# EAGLE design Pi_Block (EAGLE 7.2.0)

## Sheet 1 of 2
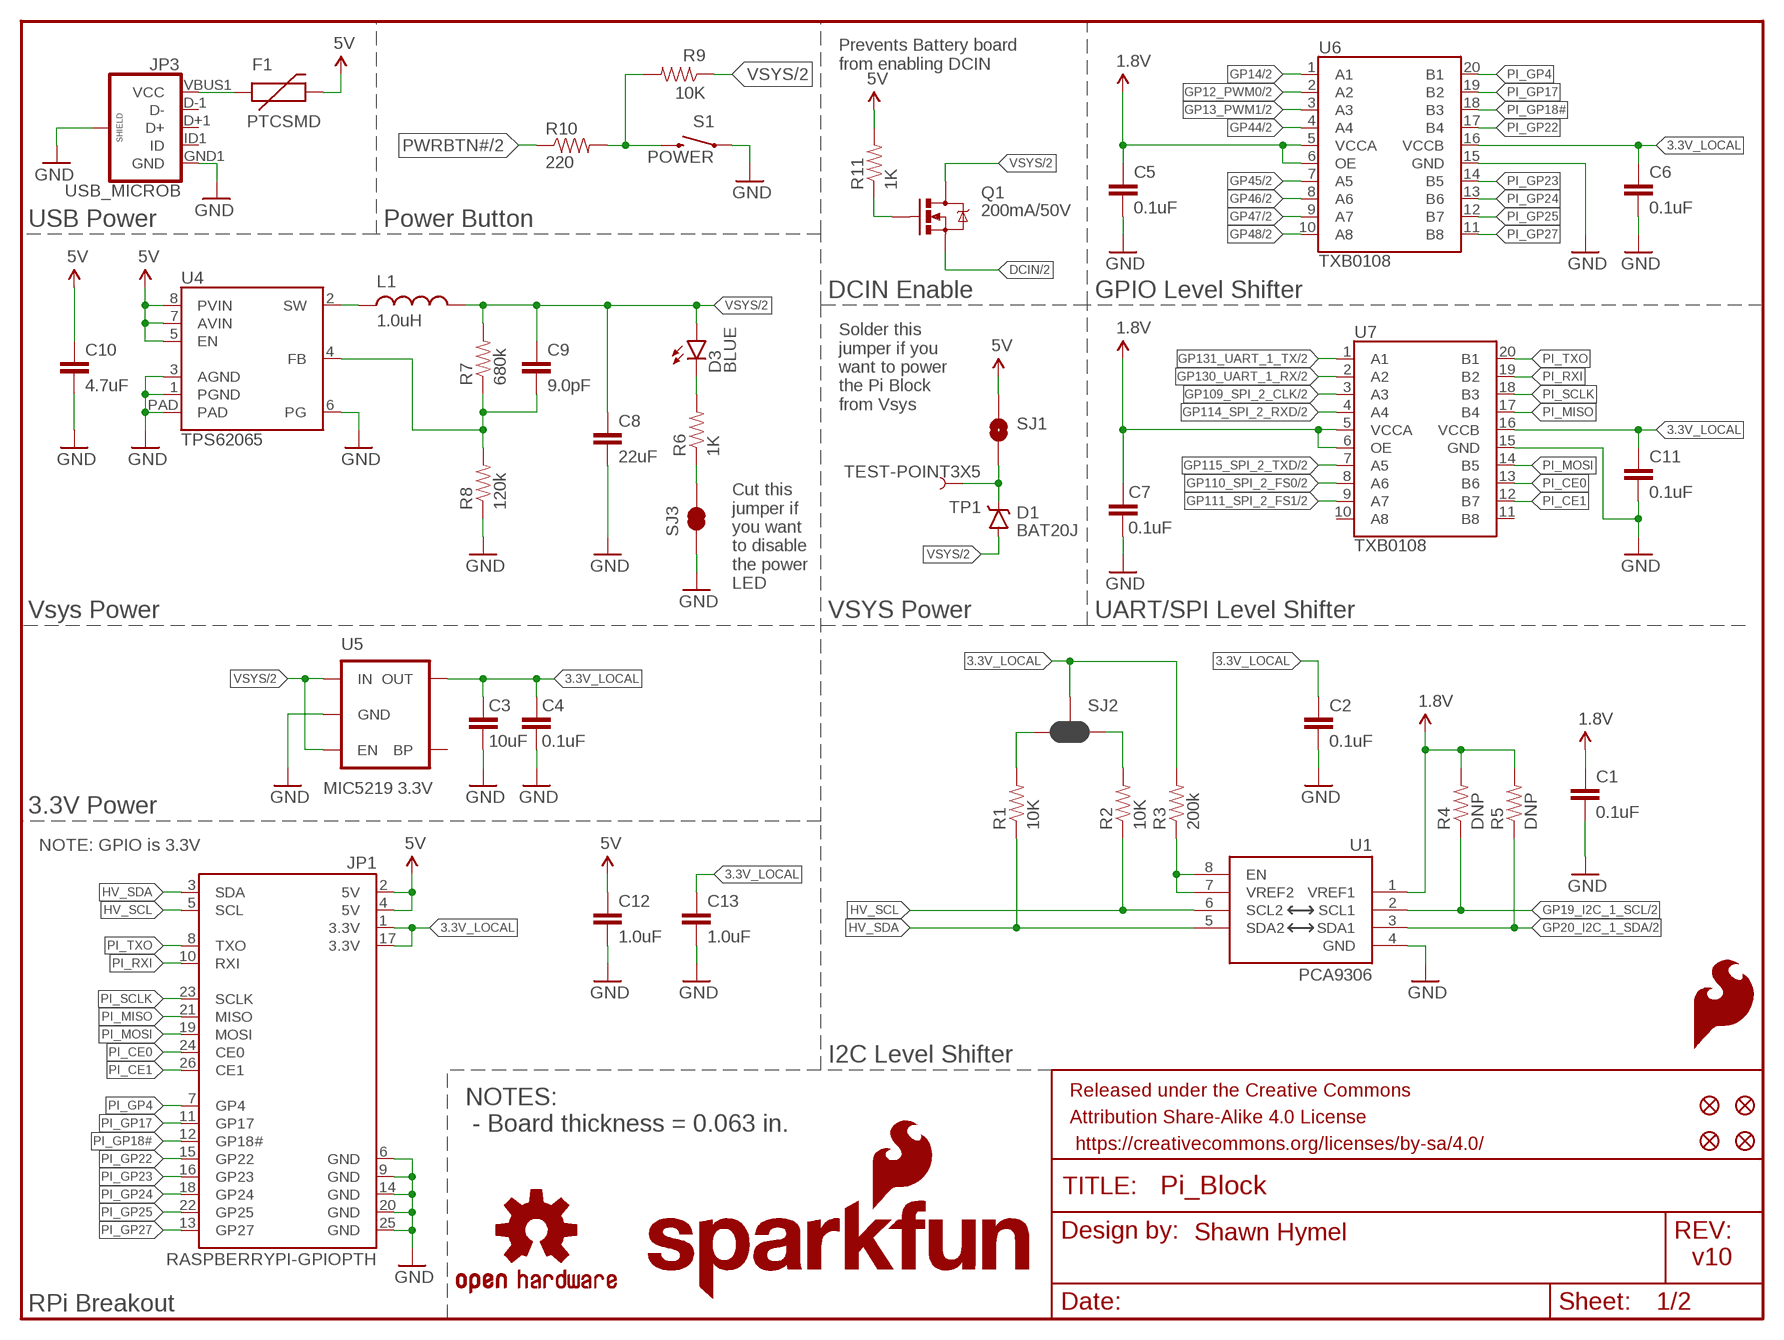
[diagram p0: schematic, sheet 1]

### Parts
C1  0.1uF  0.1UF-25V(+80/-20%)(0603)  [0603-CAP]
C2  0.1uF  0.1UF-25V(+80/-20%)(0603)  [0603-CAP]
C3  10uF  CAP0805  [0805]
C4  0.1uF  0.1UF-25V(+80/-20%)(0603)  [0603-CAP]
C5  0.1uF  0.1UF-25V(+80/-20%)(0603)  [0603-CAP]
C6  0.1uF  0.1UF-25V(+80/-20%)(0603)  [0603-CAP]
C7  0.1uF  0.1UF-25V(+80/-20%)(0603)  [0603-CAP]
C8  22uF  22UF-6.3V-20%(0805)  [0805]
C9  9.0pF  9.0PF-50V-10%(0603)  [0603-CAP]
C10  4.7uF  4.7UF-6.3V-10%(0603)0603  [0603-CAP]
C11  0.1uF  0.1UF-25V(+80/-20%)(0603)  [0603-CAP]
C12  1.0uF  1.0UF-16V-10%(0603)  [0603-CAP]
C13  1.0uF  1.0UF-16V-10%(0603)  [0603-CAP]
D1  BAT20J  DIODE-SCHOTTKY-BAT20J  [SOD-323]
D3  BLUE  LED-BLUE0603  [LED-0603]
F1  PTCSMD  [PTC-1206]
FID1  FIDUCIAL1X2  [FIDUCIAL-1X2]
FID2  FIDUCIAL1X2  [FIDUCIAL-1X2]
FID3  FIDUCIAL1X2  [FIDUCIAL-1X2]
FID4  FIDUCIAL1X2  [FIDUCIAL-1X2]
FRAME1  FRAME-LETTER  [CREATIVE_COMMONS]
FRAME3  FRAME-LETTER  [CREATIVE_COMMONS]
JP1  RASPBERRYPI-GPIOPTH  [2X13-SHROUDED]
JP3  USB_MICROB  USB_MICROB_PLUGCONN-11752  [USB-B-MICRO-SMD_V03]
L1  1.0uH  INDUCTOR  [INDUCTOR-SRP4020]
LOGO1  OSHW-LOGOS  [OSHW-LOGO-S]
LOGO3  SFE_LOGO_FLAME.2_INCH  [SFE_LOGO_FLAME_.2]
LOGO4  SFE_LOGO_NAME_FLAME.1_INCH  [SFE_LOGO_NAME_FLAME_.1]
Q1  200mA/50V  MOSFET-NCHANNELBSS138  [SOT23-3]
R1  10K  10KOHM-1/10W-1%(0603)0603  [0603-RES]
R2  10K  10KOHM-1/10W-1%(0603)0603  [0603-RES]
R3  200k  200KOHM1/10W1%(0603)200K  [0603-RES]
R4  DNP  RESISTOR0603-RES  [0603-RES]
R5  DNP  RESISTOR0603-RES  [0603-RES]
R6  1K  1KOHM-1/10W-1%(0603)  [0603-RES]
R7  680k  RESISTOR0603  [0603-RES]
R8  120k  RESISTOR0603  [0603-RES]
R9  10K  10KOHM-1/10W-1%(0603)0603  [0603-RES]
R10  220  RESISTOR0603  [0603-RES]
R11  1K  1KOHM-1/10W-1%(0603)  [0603-RES]
S1  POWER  SWITCH-MOMENTARY-2TACTILE-SWITCH-SMD-RIGHT-ANGLE  [TACTILE_SWITCH-SMD-RIGHT-ANGLE]
SJ1  JUMPER-PAD-2-NOYES_SILK  [PAD-JUMPER-2-NO_YES_SILK]
SJ2  JUMPER-PAD-3-NC_BY_PASTE  [PAD-JUMPER-3-NC_BY_PASTE_YES_SILK_FULL_BOX]
SJ3  JUMPER-PAD-2-NC_BY_TRACE  [PAD-JUMPER-2-NC_BY_TRACE_YES_SILK]
TP1  TEST-POINT3X5  [PAD.03X.05]
U1  PCA9306  PCA9306PCA9306DC-1:1  [PCA9306DC-1:1]
U4  TPS62065  [WSON-8-PAD]
U5  MIC5219 3.3V  V_REG_MIC52193.3V  [SOT23-5]
U6  TXB0108  [UFDFN-20]
U7  TXB0108  [UFDFN-20]

### Nets
1.8V: C1.1 C5.1 C7.1 R4.2 R5.2 U1.1(VREF1) U6.5(VCCA) U6.6(OE) U7.5(VCCA) U7.6(OE) ; also sheet 2
3.3V_LOCAL: C2.1 C3.1 C4.1 C6.1 C11.1 C13.1 JP1.1(3.3V) JP1.17(3.3V) R3.2 SJ2.2 U5.5(OUT) U6.16(VCCB) U7.16(VCCB)
5V: C10.1 C12.1 F1.2 JP1.2(5V) JP1.4(5V) R11.2 SJ1.1 U4.5(EN) U4.7(AVIN) U4.8(PVIN)
DCIN: Q1.2(S) ; also sheet 2
GND: C1.2 C2.2 C3.2 C4.2 C5.2 C6.2 C7.2 C8.2 C10.2 C11.2 C12.2 C13.2 JP1.6(GND) JP1.9(GND) JP1.14(GND) JP1.20(GND) JP1.25(GND) JP3.GND1(GND) JP3.SHIELD1(SHIELD) JP3.SHIELD2(SHIELD) JP3.SHIELD3(SHIELD) R8.1 S1.1 SJ3.1 U1.4(GND) U4.1(PGND) U4.3(AGND) U4.6(PG) U4.PAD U5.2(GND) U6.15(GND) U7.15(GND) ; also sheet 2
GP12_PWM0: U6.2(A2) ; also sheet 2
GP13_PWM1: U6.3(A3) ; also sheet 2
GP14: U6.1(A1) ; also sheet 2
GP19_I2C_1_SCL: R4.1 U1.2(SCL1) ; also sheet 2
GP20_I2C_1_SDA: R5.1 U1.3(SDA1) ; also sheet 2
GP44: U6.4(A4) ; also sheet 2
GP45: U6.7(A5) ; also sheet 2
GP46: U6.8(A6) ; also sheet 2
GP47: U6.9(A7) ; also sheet 2
GP48: U6.10(A8) ; also sheet 2
GP109_SPI_2_CLK: U7.3(A3) ; also sheet 2
GP110_SPI_2_FS0: U7.8(A6) ; also sheet 2
GP111_SPI_2_FS1: U7.9(A7) ; also sheet 2
GP114_SPI_2_RXD: U7.4(A4) ; also sheet 2
GP115_SPI_2_TXD: U7.7(A5) ; also sheet 2
GP130_UART_1_RX: U7.2(A2) ; also sheet 2
GP131_UART_1_TX: U7.1(A1) ; also sheet 2
HV_SCL: JP1.5(SCL) R2.1 U1.6(SCL2)
HV_SDA: JP1.3(SDA) R1.1 U1.5(SDA2)
N$1: R3.1 U1.7(VREF2) U1.8(EN)
N$2: F1.1 JP3.VBUS1(VCC)
N$3: D1.C SJ1.2 TP1.P$1
N$4: R1.2 SJ2.3
N$5: R2.2 SJ2.1
N$12: D3.C R6.2
N$13: R6.1 SJ3.2
N$15: R9.2 R10.2 S1.2
N$16: Q1.1(G) R11.1
N$18: C9.2 R7.1 R8.2 U4.4(FB)
N$19: L1.P$1 U4.2(SW)
PI_CE0: JP1.24(CE0) U7.13(B6)
PI_CE1: JP1.26(CE1) U7.12(B7)
PI_GP4: JP1.7(GP4) U6.20(B1)
PI_GP17: JP1.11(GP17) U6.19(B2)
PI_GP18#: JP1.12(GP18#) U6.18(B3)
PI_GP22: JP1.15(GP22) U6.17(B4)
PI_GP23: JP1.16(GP23) U6.14(B5)
PI_GP24: JP1.18(GP24) U6.13(B6)
PI_GP25: JP1.22(GP25) U6.12(B7)
PI_GP27: JP1.13(GP27) U6.11(B8)
PI_MISO: JP1.21(MISO) U7.17(B4)
PI_MOSI: JP1.19(MOSI) U7.14(B5)
PI_RXI: JP1.10(RXI) U7.19(B2)
PI_SCLK: JP1.23(SCLK) U7.18(B3)
PI_TXO: JP1.8(TXO) U7.20(B1)
PWRBTN#: R10.1 ; also sheet 2
VSYS: C8.1 C9.1 D1.A D3.A L1.P$2 Q1.3(D) R7.2 R9.1 U5.1(IN) U5.3(EN) ; also sheet 2
Unconnected: JP3.D+1(D+) JP3.D-1(D-) JP3.ID1(ID) U5.4(BP) U7.10(A8) U7.11(B8)

### Notes on the sheet
- Prevents Battery board
  from enabling DCIN
- USB Power | Power Button
- DCIN Enable | GPIO Level Shifter
- Solder this
  jumper if you
  want to power
  the Pi Block
  from Vsys
- Cut this
  jumper if 
  you want
  to disable
  the power
  LED
- Vsys Power | VSYS Power | UART/SPI Level Shifter
- 3.3V Power
- NOTE: GPIO is 3.3V
- I2C Level Shifter
- NOTES:
   - Board thickness = 0.063 in.
- Shawn Hymel
- v10
- RPi Breakout

## Sheet 2 of 2
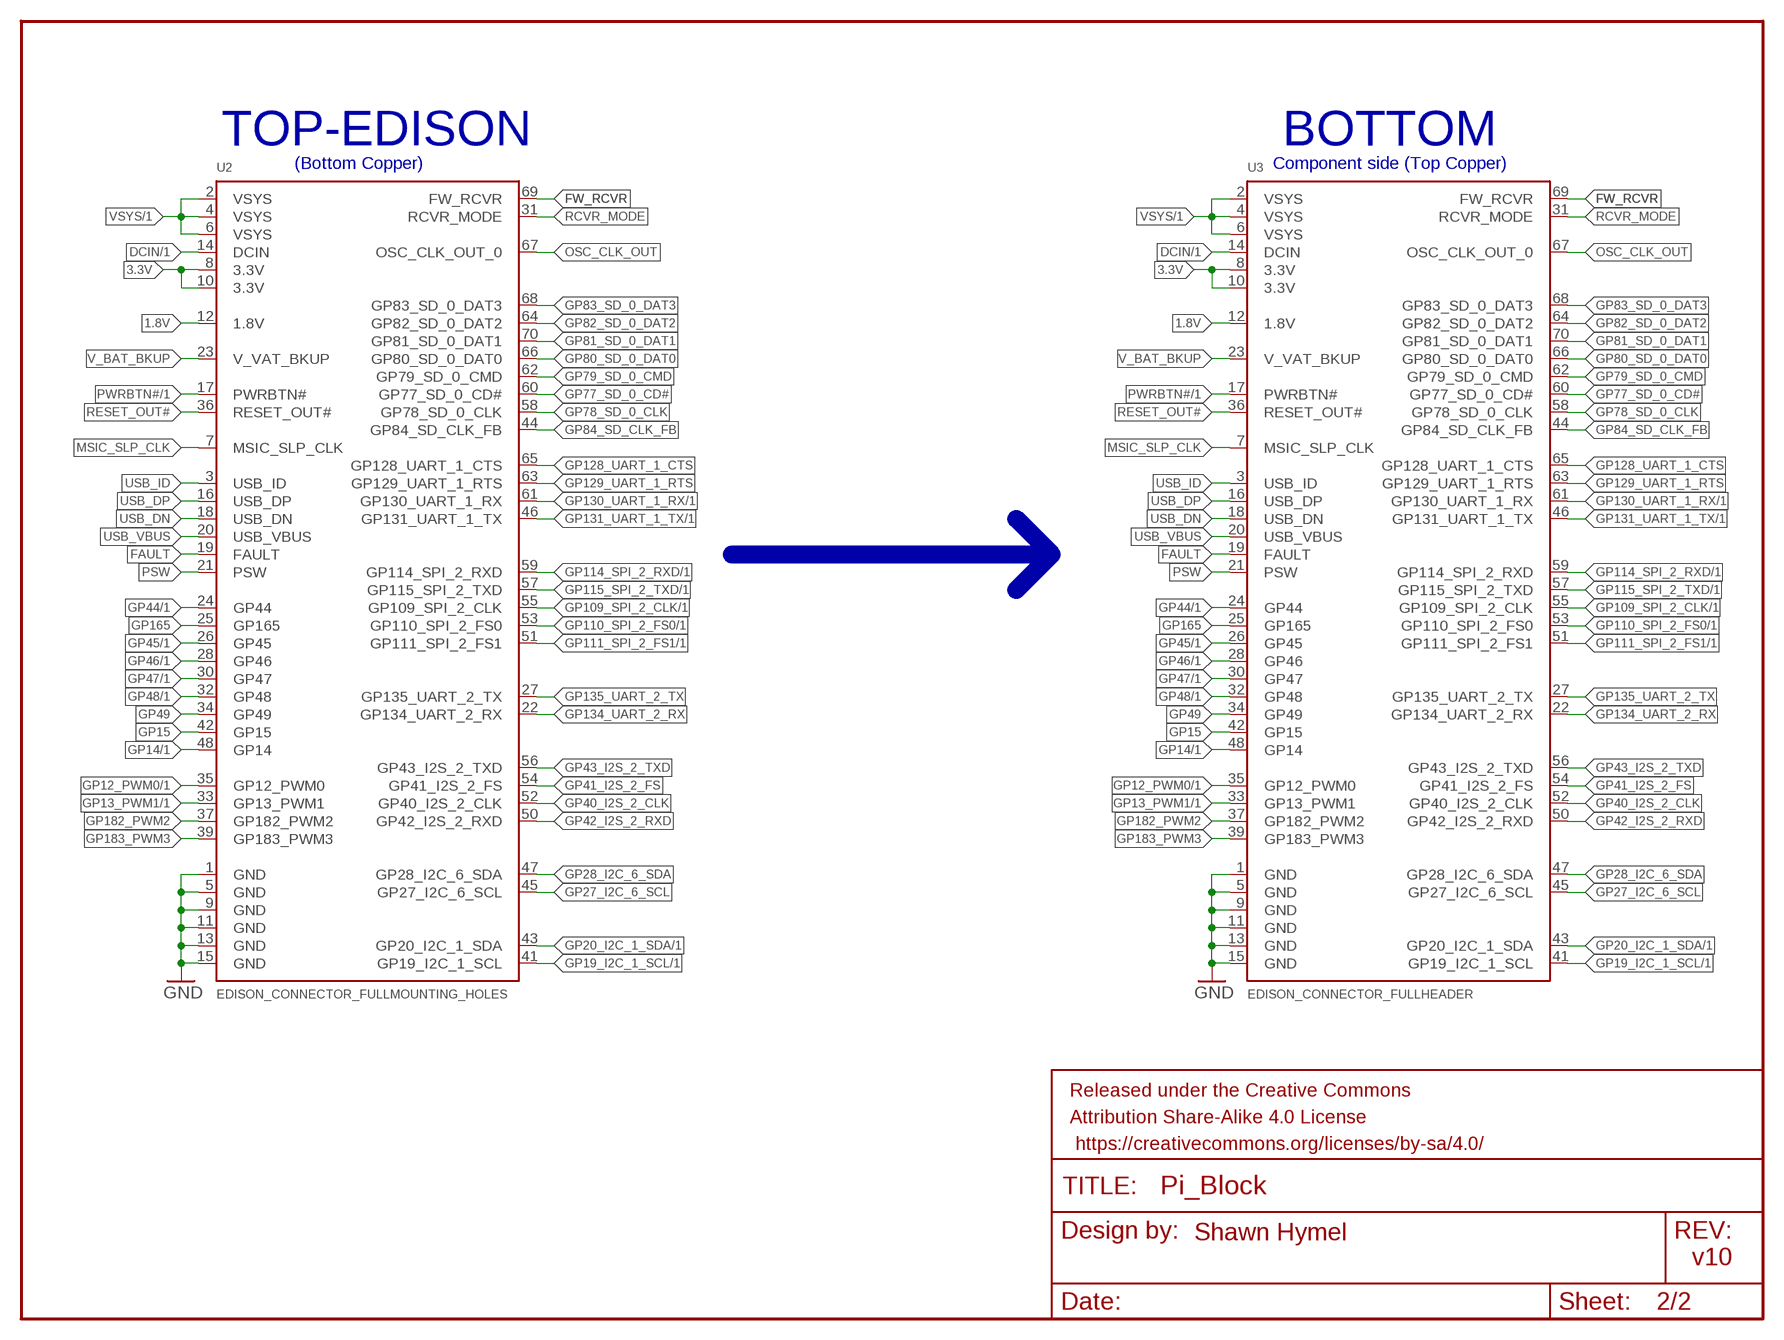
[diagram p1: schematic, sheet 2]

### Parts
FRAME2  FRAME-LETTER  [CREATIVE_COMMONS]
U2  EDISON_CONNECTOR_FULLMOUNTING_HOLES  [EDISON_DAUGHTER]
U3  EDISON_CONNECTOR_FULLHEADER  [DF40C-70DP-0.4(51)]

### Nets
1.8V: U2.12(1.8V) U3.12(1.8V) ; also sheet 1
3.3V: U2.8(3.3V) U2.10(3.3V) U3.8(3.3V) U3.10(3.3V)
DCIN: U2.14(DCIN) U3.14(DCIN) ; also sheet 1
FAULT: U2.19(FAULT) U3.19(FAULT)
FW_RCVR: U2.69(FW_RCVR) U3.69(FW_RCVR)
GND: U2.1(GND) U2.5(GND) U2.9(GND) U2.11(GND) U2.13(GND) U2.15(GND) U3.1(GND) U3.5(GND) U3.9(GND) U3.11(GND) U3.13(GND) U3.15(GND) ; also sheet 1
GP12_PWM0: U2.35(GP12_PWM0) U3.35(GP12_PWM0) ; also sheet 1
GP13_PWM1: U2.33(GP13_PWM1) U3.33(GP13_PWM1) ; also sheet 1
GP14: U2.48(GP14) U3.48(GP14) ; also sheet 1
GP15: U2.42(GP15) U3.42(GP15)
GP19_I2C_1_SCL: U2.41(GP19_I2C_1_SCL) U3.41(GP19_I2C_1_SCL) ; also sheet 1
GP20_I2C_1_SDA: U2.43(GP20_I2C_1_SDA) U3.43(GP20_I2C_1_SDA) ; also sheet 1
GP27_I2C_6_SCL: U2.45(GP27_I2C_6_SCL) U3.45(GP27_I2C_6_SCL)
GP28_I2C_6_SDA: U2.47(GP28_I2C_6_SDA) U3.47(GP28_I2C_6_SDA)
GP40_I2S_2_CLK: U2.52(GP40_I2S_2_CLK) U3.52(GP40_I2S_2_CLK)
GP41_I2S_2_FS: U2.54(GP41_I2S_2_FS) U3.54(GP41_I2S_2_FS)
GP42_I2S_2_RXD: U2.50(GP42_I2S_2_RXD) U3.50(GP42_I2S_2_RXD)
GP43_I2S_2_TXD: U2.56(GP43_I2S_2_TXD) U3.56(GP43_I2S_2_TXD)
GP44: U2.24(GP44) U3.24(GP44) ; also sheet 1
GP45: U2.26(GP45) U3.26(GP45) ; also sheet 1
GP46: U2.28(GP46) U3.28(GP46) ; also sheet 1
GP47: U2.30(GP47) U3.30(GP47) ; also sheet 1
GP48: U2.32(GP48) U3.32(GP48) ; also sheet 1
GP49: U2.34(GP49) U3.34(GP49)
GP77_SD_0_CD#: U2.60(GP77_SD_0_CD#) U3.60(GP77_SD_0_CD#)
GP78_SD_0_CLK: U2.58(GP78_SD_0_CLK) U3.58(GP78_SD_0_CLK)
GP79_SD_0_CMD: U2.62(GP79_SD_0_CMD) U3.62(GP79_SD_0_CMD)
GP80_SD_0_DAT0: U2.66(GP80_SD_0_DAT0) U3.66(GP80_SD_0_DAT0)
GP81_SD_0_DAT1: U2.70(GP81_SD_0_DAT1) U3.70(GP81_SD_0_DAT1)
GP82_SD_0_DAT2: U2.64(GP82_SD_0_DAT2) U3.64(GP82_SD_0_DAT2)
GP83_SD_0_DAT3: U2.68(GP83_SD_0_DAT3) U3.68(GP83_SD_0_DAT3)
GP84_SD_CLK_FB: U2.44(GP84_SD_CLK_FB) U3.44(GP84_SD_CLK_FB)
GP109_SPI_2_CLK: U2.55(GP109_SPI_2_CLK) U3.55(GP109_SPI_2_CLK) ; also sheet 1
GP110_SPI_2_FS0: U2.53(GP110_SPI_2_FS0) U3.53(GP110_SPI_2_FS0) ; also sheet 1
GP111_SPI_2_FS1: U2.51(GP111_SPI_2_FS1) U3.51(GP111_SPI_2_FS1) ; also sheet 1
GP114_SPI_2_RXD: U2.59(GP114_SPI_2_RXD) U3.59(GP114_SPI_2_RXD) ; also sheet 1
GP115_SPI_2_TXD: U2.57(GP115_SPI_2_TXD) U3.57(GP115_SPI_2_TXD) ; also sheet 1
GP128_UART_1_CTS: U2.65(GP128_UART_1_CTS) U3.65(GP128_UART_1_CTS)
GP129_UART_1_RTS: U2.63(GP129_UART_1_RTS) U3.63(GP129_UART_1_RTS)
GP130_UART_1_RX: U2.61(GP130_UART_1_RX) U3.61(GP130_UART_1_RX) ; also sheet 1
GP131_UART_1_TX: U2.46(GP131_UART_1_TX) U3.46(GP131_UART_1_TX) ; also sheet 1
GP134_UART_2_RX: U2.22(GP134_UART_2_RX) U3.22(GP134_UART_2_RX)
GP135_UART_2_TX: U2.27(GP135_UART_2_TX) U3.27(GP135_UART_2_TX)
GP165: U2.25(GP165) U3.25(GP165)
GP182_PWM2: U2.37(GP182_PWM2) U3.37(GP182_PWM2)
GP183_PWM3: U2.39(GP183_PWM3) U3.39(GP183_PWM3)
MSIC_SLP_CLK: U2.7(MSIC_SLP_CLK) U3.7(MSIC_SLP_CLK)
OSC_CLK_OUT: U2.67(OSC_CLK_OUT_0) U3.67(OSC_CLK_OUT_0)
PSW: U2.21(PSW) U3.21(PSW)
PWRBTN#: U2.17(PWRBTN#) U3.17(PWRBTN#) ; also sheet 1
RCVR_MODE: U2.31(RCVR_MODE) U3.31(RCVR_MODE)
RESET_OUT#: U2.36(RESET_OUT#) U3.36(RESET_OUT#)
USB_DN: U2.18(USB_DN) U3.18(USB_DN)
USB_DP: U2.16(USB_DP) U3.16(USB_DP)
USB_ID: U2.3(USB_ID) U3.3(USB_ID)
USB_VBUS: U2.20(USB_VBUS) U3.20(USB_VBUS)
V_BAT_BKUP: U2.23(V_VAT_BKUP) U3.23(V_VAT_BKUP)
VSYS: U2.2(VSYS) U2.4(VSYS) U2.6(VSYS) U3.2(VSYS) U3.4(VSYS) U3.6(VSYS) ; also sheet 1

### Buses
B$1

### Notes on the sheet
- TOP-EDISON | BOTTOM
- (Bottom Copper) | Component side (Top Copper)
- Shawn Hymel
- v10

## Library data of the parts
C1 C2 C4-C7 C11 = SparkFun-Capacitors:0.1UF-25V(+80/-20%)(0603): CAP-00810 Ceramic Standard decoupling cap; PROD_ID: CAP-00810
C3 = SparkFun-Capacitors:CAP: Capacitor Standard 0603 ceramic capacitor, and 0.1" leaded capacitor.; PROD_ID: CAP-11330
C8 = SparkFun-Capacitors:22UF-6.3V-20%(0805): CAP-08402 Ceramic; PROD_ID: CAP-08402
C9 = SparkFun-Capacitors:9.0PF-50V-10%(0603): CAP-09341; PROD_ID: CAP-09341
C10 = SparkFun-Capacitors:4.7UF-6.3V-10%(0603): CAP-08280; PROD_ID: CAP-08280
C12 C13 = SparkFun-Capacitors:1.0UF-16V-10%(0603): CAP-00868; PROD_ID: CAP-00868
D1 = SparkFun-DiscreteSemi:DIODE-SCHOTTKY: Schottky diodes in SFE's production catalog BAT20J 1A 23V 0.62Vf RB751 120mA 40V 0.37Vf PMEG4005EJ 0.5A 40V 0.42Vf MBRA140 1A 40V 0.5Vf B340A 3A 40V SMA; PROD_ID: DIO-11623
D3 = SparkFun-LED:LED-BLUE: Blue LEDs for production use Various blue LEDs stocked by SparkFun production 0603 - DIO-08575 Rebel - DIO-09553 1206 - DIO-09911; PROD_ID: DIO-08575
F1 = SparkFun-PowerIC:PTC: Resettable Fuse PTC Resettable Fuse. Spark Fun Electronics SKU : COM-08357; PROD_ID: RES-11150
FID1-FID4 = SparkFun-Aesthetics:FIDUCIAL: Fiducial Alignment Points Various fiducial points for machine vision alignment.
FRAME1-FRAME3 = SparkFun-Aesthetics:FRAME-LETTER: Schematic Frame Standard 8.5x11 US Letter frame
JP1 = SparkFun-Boards:RASPBERRYPI-GPIO: RASPBERRY PI I/O HEADER As defined for the Revistion 2 Pi.; DIST: sparkfun; DIST_ID: PRT-11490
JP3 = SparkFun-Connectors:USB_MICROB_PLUG: USB Micro-B connectors Some male, some female. Watch your step!; PROD_ID: CONN-11752
L1 = SparkFun-Passives:INDUCTOR: Inductors Basic Inductor/Choke - 0603 and 1206. Footprints are not proven and vary greatly between part numbers. SRN6045- 33uH, 20% 1.4A SDR0403-560KL - 56uH, 10%, 500mA RMS/740mA peak; PROD_ID: NDUC-12274
LOGO1 = SparkFun-Aesthetics:OSHW-LOGO: Open Source Hardware Logo This logo indicates the piece of hardware it is found on incorporates a OSHW license and/or adheres to the definition of open source hardware found here: http://freedomdefined.org/OSHW
LOGO3 = SparkFun-Aesthetics:SFE_LOGO_FLAME: SFE Logo, flame only This is the SparkFun flame logo. The logo on the schematic will always be the same size; the package variant is the height of the flame. Default layer for the logo on the board is tSilk.
LOGO4 = SparkFun-Aesthetics:SFE_LOGO_NAME_FLAME: SFE Logo, name and flame This is the SparkFun full logo. The logo on the schematic will always be the same size; the package variant is the height of the flame part of the logo. Default layer for the logo on the board is tSilk.
Q1 = SparkFun-DiscreteSemi:MOSFET-NCHANNEL: Common NMOSFET Parts MFG P/N Store ID Prod ID FDD8780 TRANS-09984 SI7820DN TRANS-11055 FDS6630A IC-08089 2N7002PW TRANS-11151 FQP30N06L COM-10213 TRANS-10060 BSS123LT1G TRANS-08345 BSS138 TRANS-00830 BS170 2N7000; PROD_ID: TRANS-00830
R1 R2 R9 = SparkFun-Resistors:10KOHM-1/10W-1%(0603): RES-00824; PROD_ID: RES-00824
R3 = SparkFun-Resistors:200KOHM1/10W1%(0603): RES-09385; PROD_ID: RES-09385
R4 R5 = SparkFun-Resistors:RESISTOR: Resistor Basic schematic elements and footprints for 0603, 1206, and PTH resistors.
R6 R11 = SparkFun-Resistors:1KOHM-1/10W-1%(0603): RES-07856; PROD_ID: RES-07856
R7 = SparkFun-Resistors:RESISTOR: Resistor Basic schematic elements and footprints for 0603, 1206, and PTH resistors.; PROD_ID: RES-12280
R8 = SparkFun-Resistors:RESISTOR: Resistor Basic schematic elements and footprints for 0603, 1206, and PTH resistors.; PROD_ID: RES-12279
R10 = SparkFun-Resistors:RESISTOR: Resistor Basic schematic elements and footprints for 0603, 1206, and PTH resistors.; PROD_ID: RES-07861
S1 = SparkFun-Electromechanical:SWITCH-MOMENTARY-2: Various NO switches- pushbuttons, reed, etc; PROD_ID: COMP-12265
SJ1 = SparkFun-Passives:JUMPER-PAD-2-NO
SJ2 = SparkFun-Passives:JUMPER-PAD-3-NC_BY_PASTE
SJ3 = SparkFun-Passives:JUMPER-PAD-2-NC_BY_TRACE
TP1 = SparkFun-Passives:TEST-POINT: Bare copper test points for troubleshooting or ICT
U1 = SparkFun-DigitalIC:PCA9306: Bidirectional I2C level shifter. NOT compatible with all available part number pinout schemes- DOUBLE CHECK!!!; PROD_ID: IC-10023
U2 U3 = Edison:EDISON_CONNECTOR_FULL
U4 = SparkFun-PowerIC:TPS62065: TPS62065 DC/DC step-Down regulator.; PROD_ID: IC-12273
U5 = SparkFun-PowerIC:V_REG_MIC5219: V_REG MIC5219 Standard 3.3V and 5V 500mA LDO voltage regulator in SOT-23 layout. Micrel part MIC5219. BP (by-pass) pin is used to lower output noise with 470pF cap, may be left open.; PROD_ID: VREG-09872
U6 U7 = SparkFun-DigitalIC:TXB0108: 8-Bit Bi-Directional Level Shifter 1.2V-3.6V (VCCA) to 1.65V-5.5V (VCCB) bi-directional level shifter with auto direction sensing. Max data rate - VCCA 1.2V: 20Mbps (50ns), VCCA 3.3V: 100Mbps (10ns) Digikey: 296-27217-1-ND (20-UFDFN) IC-12292; PROD_ID: IC-12292

## Board
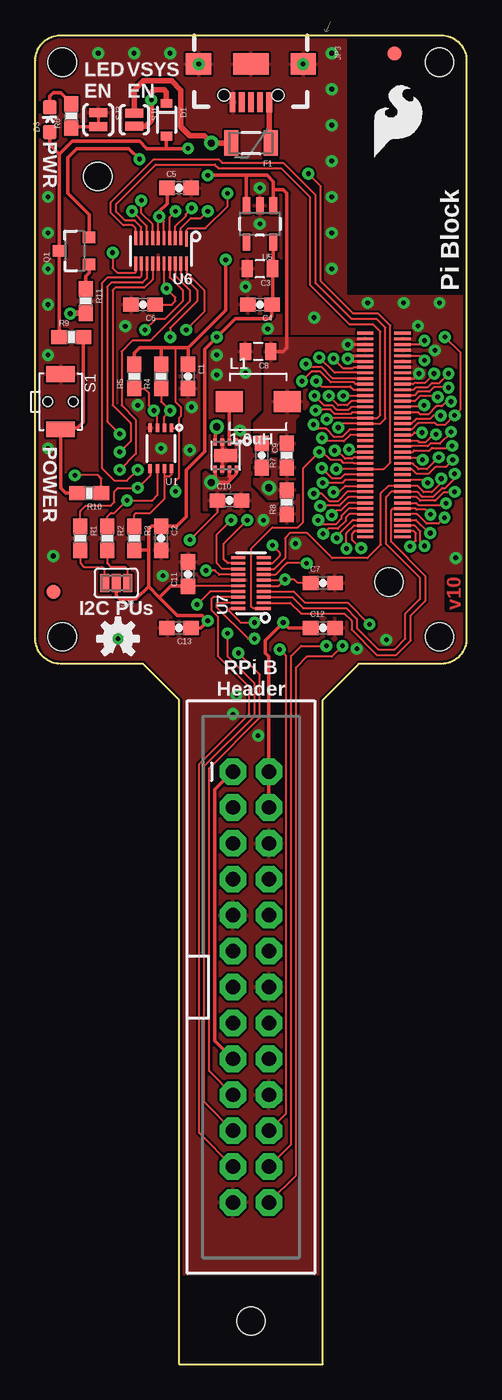
[diagram p2: board, top side]
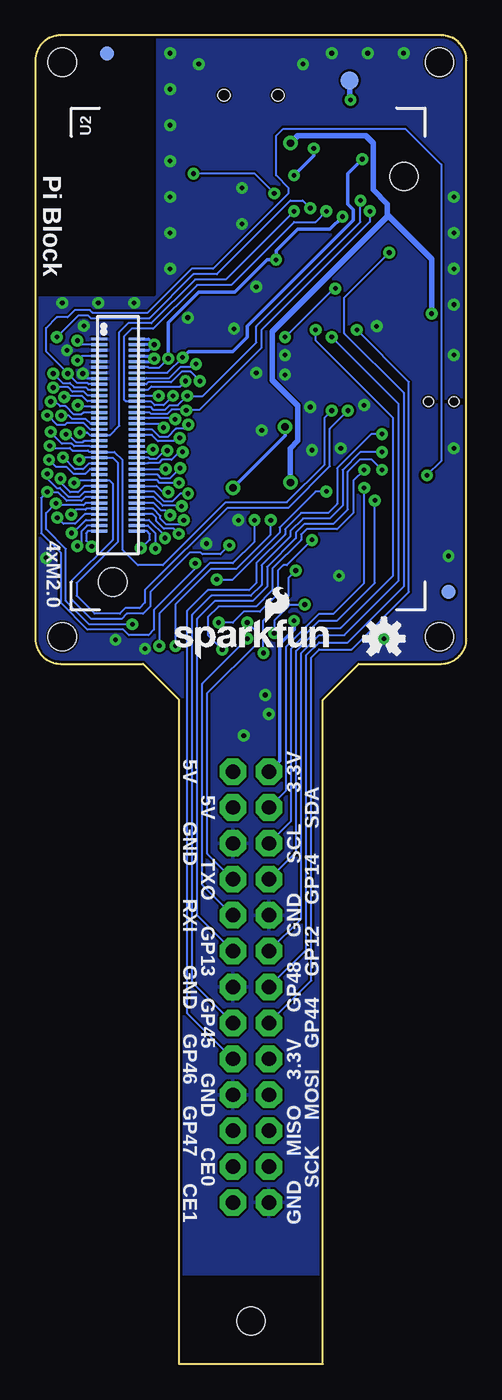
[diagram p3: board, bottom side, seen from below]

Size 30.48 x 93.98 mm. Coordinates in mm from the lower left corner, seen from the top.
Outline: 30.48,92.2 30.48,51.31 arc-90 28.7,49.53 22.86,49.53 20.32,46.99 20.32,0 10.16,0 10.16,46.99 7.62,49.53 1.78,49.53 arc-90 0,51.31 0,92.2 arc-90 1.78,93.98 28.7,93.98 arc-90 30.48,92.2
Copper layers (1*16): Top 0.035mm / dielectric 1.5mm / Bottom 0.035mm
Design rules "Pi_Block *": minimum track width 6mil, minimum drill 13mil, track to track 6mil, track to pad 6mil, pad to pad 6mil, via to via 6mil, smd to smd 6mil, copper to edge 6mil, drill to drill 6mil, minimum pad ring 12mil, minimum via ring 10mil, stop-mask expansion 4mil, vias tented up to drill 20mil, thermal gap 6mil
Holes 2 mm at 28.57,51.44 1.91,51.44 1.91,92.08 28.57,92.08 15.24,3.05
tRestrict: area 22.1,75.7 to 30.5,94; 13 lines
bRestrict: area 22.1,75.7 to 30.5,94; 3 lines

### Footprints (pad centres in the part's own frame; a part is rotated, then mirrored left to right if it is on the bottom)
0603-CAP = smd 1.1 x 1: 1 -0.85,0; 2 0.85,0
0805 = smd 0.8 x 1.2: 1 -0.9,0; 2 0.9,0
SOD-323 = smd 0.63 x 0.83: A 1.15,0; C -1.15,0
LED-0603 = smd 1 x 1: A 0,-0.877; C 0,0.877
PTC-1206 = smd 1 x 1.8: 1 -1.4,0; 2 1.4,0
FIDUCIAL-1X2 = smd 1 x 1: 1 0,0
2X13-SHROUDED = drill 1.016 pad 1.88 octagon: 1 -1.27,15.24; 2 1.27,15.24; 3 -1.27,12.7; 4 1.27,12.7; 5 -1.27,10.16; 6 1.27,10.16; 7 -1.27,7.62; 8 1.27,7.62; 9 -1.27,5.08; 10 1.27,5.08; 11 -1.27,2.54; 12 1.27,2.54; 13 -1.27,0; 14 1.27,0; 15 -1.27,-2.54; 16 1.27,-2.54; 17 -1.27,-5.08; 18 1.27,-5.08; 19 -1.27,-7.62; 20 1.27,-7.62; 21 -1.27,-10.16; 22 1.27,-10.16; 23 -1.27,-12.7; 24 1.27,-12.7; 25 -1.27,-15.24; 26 1.27,-15.24
USB-B-MICRO-SMD_V03 = smd 1.4 x 0.4: D+1 2.7,0; D-1 2.7,0.65; GND1 2.7,-1.3; ID1 2.7,-0.65; VBUS1 2.7,1.3 | smd 1.5 x 1.8: SHIELD1 0,3.7; SHIELD2 0,-3.7 | smd 1.5 x 2.5: SHIELD3 0,0 | hole 0.85: 2.2,1.9; 2.2,-1.9
INDUCTOR-SRP4020 = smd 1.9 x 1.5: P$1 -2.05,0; P$2 2.05,0
SOT23-3 = smd 0.8 x 0.9: 1 -0.95,-1; 2 0.95,-1; 3 0,1.1
0603-RES = smd 1.1 x 1: 1 -0.85,0; 2 0.85,0
TACTILE_SWITCH-SMD-RIGHT-ANGLE = smd 1.1 x 2: 1 -1.95,0; 2 1.95,0 | hole 0.7: 0,0.9; 0,-0.9
PAD-JUMPER-2-NO_YES_SILK = smd 0.635 x 1.27: 1 -0.45,0; 2 0.45,0
PAD-JUMPER-3-NC_BY_PASTE_YES_SILK_FULL_BOX = smd 0.635 x 1.27: 1 -0.813,0; 2 0,0; 3 0.813,0
PAD-JUMPER-2-NC_BY_TRACE_YES_SILK = smd 0.635 x 1.27: 1 -0.508,0; 2 0.508,0
PAD.03X.05 = smd 1.27 x 1.27: P$1 0,0
PCA9306DC-1:1 = smd 0.25 x 0.602: 1 -0.73,-1.446; 2 -0.23,-1.446; 3 0.27,-1.446; 4 0.77,-1.446; 5 0.77,1.431; 6 0.27,1.431; 7 -0.23,1.431; 8 -0.73,1.431
EDISON_DAUGHTER = smd 1.14 x 0.2: 1 1.98,19.17; 2 4.62,19.17; 3 1.98,18.77; 4 4.62,18.77; 5 1.98,18.37; 6 4.62,18.37; 7 1.98,17.97; 8 4.62,17.97; 9 1.98,17.57; 10 4.62,17.57; 11 1.98,17.17; 12 4.62,17.17; 13 1.98,16.77; 14 4.62,16.77; 15 1.98,16.37; 16 4.62,16.37; 17 1.98,15.97; 18 4.62,15.97; 19 1.98,15.57; 20 4.62,15.57; 21 1.98,15.17; 22 4.62,15.17; 23 1.98,14.77; 24 4.62,14.77; 25 1.98,14.37; 26 4.62,14.37; 27 1.98,13.97; 28 4.62,13.97; 29 1.98,13.57; 30 4.62,13.57; 31 1.98,13.17; 32 4.62,13.17; 33 1.98,12.77; 34 4.62,12.77; 35 1.98,12.37; 36 4.62,12.37; 37 1.98,11.97; 38 4.62,11.97; 39 1.98,11.57; 40 4.62,11.57; 41 1.98,11.17; 42 4.62,11.17; 43 1.98,10.77; 44 4.62,10.77; 45 1.98,10.37; 46 4.62,10.37; 47 1.98,9.97; 48 4.62,9.97; 49 1.98,9.57; 50 4.62,9.57; 51 1.98,9.17; 52 4.62,9.17; 53 1.98,8.77; 54 4.62,8.77; 55 1.98,8.37; 56 4.62,8.37; 57 1.98,7.97; 58 4.62,7.97; 59 1.98,7.57; 60 4.62,7.57; 61 1.98,7.17; 62 4.62,7.17; 63 1.98,6.77; 64 4.62,6.77; 65 1.98,6.37; 66 4.62,6.37; 67 1.98,5.97; 68 4.62,5.97; 69 1.98,5.57; 70 4.62,5.57 | hole 2: 23.53,30.67; 2.93,1.98
DF40C-70DP-0.4(51) = smd 0.2 x 1.14 bottom: 1 6.8,1.32; 2 6.8,-1.32; 3 6.4,1.32; 4 6.4,-1.32; 5 6,1.32; 6 6,-1.32; 7 5.6,1.32; 8 5.6,-1.32; 9 5.2,1.32; 10 5.2,-1.32; 11 4.8,1.32; 12 4.8,-1.32; 13 4.4,1.32; 14 4.4,-1.32; 15 4,1.32; 16 4,-1.32; 17 3.6,1.32; 18 3.6,-1.32; 19 3.2,1.32; 20 3.2,-1.32; 21 2.8,1.32; 22 2.8,-1.32; 23 2.4,1.32; 24 2.4,-1.32; 25 2,1.32; 26 2,-1.32; 27 1.6,1.32; 28 1.6,-1.32; 29 1.2,1.32; 30 1.2,-1.32; 31 0.8,1.32; 32 0.8,-1.32; 33 0.4,1.32; 34 0.4,-1.32; 35 0,1.32; 36 0,-1.32; 37 -0.4,1.32; 38 -0.4,-1.32; 39 -0.8,1.32; 40 -0.8,-1.32; 41 -1.2,1.32; 42 -1.2,-1.32; 43 -1.6,1.32; 44 -1.6,-1.32; 45 -2,1.32; 46 -2,-1.32; 47 -2.4,1.32; 48 -2.4,-1.32; 49 -2.8,1.32; 50 -2.8,-1.32; 51 -3.2,1.32; 52 -3.2,-1.32; 53 -3.6,1.32; 54 -3.6,-1.32; 55 -4,1.32; 56 -4,-1.32; 57 -4.4,1.32; 58 -4.4,-1.32; 59 -4.8,1.32; 60 -4.8,-1.32; 61 -5.2,1.32; 62 -5.2,-1.32; 63 -5.6,1.32; 64 -5.6,-1.32; 65 -6,1.32; 66 -6,-1.32; 67 -6.4,1.32; 68 -6.4,-1.32; 69 -6.8,1.32; 70 -6.8,-1.32; NC1 7.2,1.32; NC2 7.2,-1.32; NC3 -7.2,-1.32; NC4 -7.2,1.32
WSON-8-PAD = smd 0.25 x 0.5: 1 -0.75,-0.95; 2 -0.25,-0.95; 3 0.25,-0.95; 4 0.75,-0.95; 5 0.75,0.95; 6 0.25,0.95; 7 -0.25,0.95; 8 -0.75,0.95 | smd 1.6 x 0.9: PAD 0,0
SOT23-5 = smd 0.55 x 1.2: 1 -0.95,-1.3; 2 0,-1.3; 3 0.95,-1.3; 4 0.95,1.3; 5 -0.95,1.3
UFDFN-20 = smd 0.2 x 1.1: 1 -1.8,-0.85 | smd 0.2 x 1: 2 -1.4,-0.9; 3 -1,-0.9; 4 -0.6,-0.9; 5 -0.2,-0.9; 6 0.2,-0.9; 7 0.6,-0.9; 8 1,-0.9; 9 1.4,-0.9; 10 1.8,-0.9; 11 1.8,0.9; 12 1.4,0.9; 13 1,0.9; 14 0.6,0.9; 15 0.2,0.9; 16 -0.2,0.9; 17 -0.6,0.9; 18 -1,0.9; 19 -1.4,0.9; 20 -1.8,0.9

### Placement (x,y rotation side)
C1  10.79,69.85 270 top
C2  8.89,58.42 270 top
C3  15.88,77.47 180 top
C4  15.88,74.93 180 top
C5  10.16,83.19 0 top
C6  7.62,74.93 180 top
C7  20.32,55.25 0 top
C8  15.75,71.63 180 top
C9  16,64.26 270 top
C10  13.72,61.09 0 top
C11  10.79,55.88 90 top
C12  20.32,52.07 0 top
C13  10.16,52.07 180 top
D1  9.27,88.01 270 top
D3  1.02,88.01 0 top
F1  15.24,86.36 180 top
FID1  1.27,54.61 0 top
FID2  25.4,92.71 0 top
FID3  1.27,54.61 0 bottom
FID4  25.4,92.71 0 bottom
FRAME1  -1.27,-16.51 0 top  (outside the outline)
FRAME2  -1.27,-16.51 0 top  (outside the outline)
FRAME3  -1.27,-16.51 0 top  (outside the outline)
JP1  15.24,26.67 0 top
JP3  15.24,91.95 270 top
L1  15.75,68.07 0 top
LOGO1  5.84,51.31 0 top
LOGO2  OSHW-LOGOS  [OSHW-LOGO-S]  5.84,51.31 0 bottom
LOGO3  23.62,85.09 0 top
LOGO4  21.08,49.78 0 bottom
Q1  2.79,78.74 90 top
R1  3.17,58.42 270 top
R2  5.08,58.42 270 top
R3  6.99,58.42 270 top
R4  8.89,69.85 90 top
R5  6.99,69.85 90 top
R6  2.54,88.27 90 top
R7  17.78,64.26 90 top
R8  17.78,60.96 90 top
R9  2.54,72.64 0 top
R10  3.81,61.59 180 top
R11  3.56,75.18 270 top
S1  1.78,68.07 270 top
SJ1  6.99,88.01 270 top
SJ2  5.71,55.25 180 top
SJ3  4.45,88.01 270 top
TP1  8.26,90.81 0 bottom
U1  8.89,64.77 180 top
U2  27.94,53.34 0 bottom
U3  24.64,65.71 90 bottom
U4  13.46,64.26 180 top
U5  15.88,80.64 180 top
U6  8.89,78.74 180 top
U7  15.24,55.25 90 top

### Tracks (layer width: path | path; a pad name or v marks a point on that pad's centre or on a via)
1.8V  (via drill 0.33)
  Top 0.152: U3.12 22.5,70.51 22.45,70.46 21.74,70.46 v21.08,71.12 | 9.91,71.88 9.91,68.07 10.29,67.69 10.29,67.06 10.16,66.93 10.16,66.22 | 10.79,71.75 10.67,71.88 | C7.1 18.54,55.25 18.29,55.5 v17.65,55.5 | v9.91,61.72 9.91,62.48 10.16,62.74 10.16,66.22 | U1.1 10.16,66.22 | U6.5 9.09,80.83 v8.76,81.15 8.69,81.08 U6.6 | U7.6 17.6,55.45 v17.65,55.5 | U7.5 17.2,55.05 v17.65,55.5
  Top 0.254: C5.1 9.31,82.08 8.76,81.53 v8.76,81.15 | 8.89,71.88 7.37,71.88 6.99,71.5 R5.2 | 8.89,71.88 9.91,71.88 10.67,71.88 10.79,71.88 13.46,74.55 v13.46,78.11 | C1.1 10.79,71.75 | R4.2 8.89,71.88
  Bottom 0.152: U3.12 22.5,70.51 22.45,70.46 21.74,70.46 v21.08,71.12 | v9.91,61.72 10.67,61.72 13.21,59.18 13.21,58.8 16.51,55.5 v17.65,55.5
  Bottom 0.254: v21.08,71.12 21.08,73.66 18.92,75.82 16.38,75.82 14.1,78.11 v13.46,78.11 13.46,78.74 11.94,80.26 9.65,80.26 v8.76,81.15
3.3V  (via drill 0.33)
  Top 0.198: U3.8 22.28,71.31 v22.08,71.11 22.28,70.91 U3.10
  Bottom 0.152: U3.8
  Bottom 0.198: U3.8 22.28,71.31 v22.08,71.11 22.28,70.91 U3.10
3.3V_LOCAL  (via drill 0.33)
  Top 0.152: C6.1 9.65,74.93 9.91,75.18 9.91,75.44 v9.27,76.07 9.09,76.25 U6.16 | U7.16 10.81,55.05 C11.1
  Top 0.254: R3.2 7.91,57.57 8,57.66 | JP1.17 12.7,22.86 12.7,40.64 JP1.1 | 8,57.66 8,59.05 8.22,59.27 C2.1 9.99,59.27 10.67,59.94 10.67,63.25 11.96,64.54 11.96,71.78 v12.83,72.64 14.12,73.94 16.54,73.94 16.73,74.13 C4.1 16.77,74.98 C3.1 16.82,77.52 U5.5 | 8,57.66 8,54.99 | 8,54.99 8.76,54.23 | 8.76,54.23 10.03,52.96 11.81,52.96 v12.19,52.58 11.68,52.07 C13.1 | C11.1 9.56,55.03 8.76,54.23 | SJ2.2 5.71,54.36 5.97,54.1 7.11,54.1 8,54.99
  Bottom 0.152: v9.27,76.07 9.4,76.07 v12.83,72.64
  Bottom 0.254: v12.19,52.58 12.19,51.94 13.21,50.93 13.21,42.67 JP1.1
5V  (via drill 0.33, 0.51)
  Top 0.152: C10.1 12.87,60.24 v10.92,58.29
  Top 0.254: JP1.4 JP1.2 16.51,50.04 16.26,50.29 16.26,51.18 v17.53,52.45 17.91,52.07 C12.1 | U4.5 12.71,62.62 v12.45,62.36 13.59,62.36 14.02,62.79 | U4.8 14.21,62.98 14.02,62.79 | 14.02,62.79 13.72,62.79 13.71,62.79 U4.7
  Top 0.381: F1.2 v12.45,86.36 11.94,86.87 10.92,86.87 10.29,87.5 10.29,90.09 9.63,90.75 7.64,90.75 6.99,90.09 SJ1.1 | R11.2 2.5,74.33 v2.46,74.3
  Bottom 0.152: v10.92,58.29 12.7,56.52 12.95,56.52 13.34,56.13 13.34,54.48 14.61,53.21 15.75,53.21 16.51,52.45 v17.53,52.45
  Bottom 0.381: v12.45,62.36 12.45,64.77 11.91,65.3 11.91,67.79 13.72,69.6 13.72,73.03 5.59,81.15 5.59,81.28 | 5.59,81.28 5.59,82.04 6.6,83.06 6.6,86.36 7.11,86.87 11.94,86.87 v12.45,86.36 | v2.46,74.3 2.46,78.16 5.59,81.28
  pour Top (isolate 0.305): 13.46,60.45 11.94,60.45 11.94,62.99 12.57,63.63 14.35,63.63 14.35,63.12 13.46,62.23
DCIN  (via drill 0.33)
  Top 0.152: U2.14 21.15,70.11 v20.07,71.2
  Top 0.254: v7.37,85.22 6.6,85.98 2.92,85.98 2.29,85.34 2.29,82.8 3.79,81.3 Q1.2
  Bottom 0.152: v20.07,71.2 21.15,70.11 U2.14
  Bottom 0.254: v20.07,71.2 19.63,71.63 16.51,71.63 15.49,72.64 15.49,73.41 8,80.9 8,81.66 8.38,82.04 8.38,84.2 v7.37,85.22
FAULT  (via drill 0.33)
  Top 0.152: U3.19 26.75,68.91 26.92,69.09 27.74,69.09 28.04,69.39 28.55,69.39 v29.21,70.05
  Bottom 0.152: v29.21,70.05 28.55,69.39 28.04,69.39 27.74,69.09 26.92,69.09 26.75,68.91 U3.19
FW_RCVR  (via drill 0.33)
  Top 0.152: v26.49,57.84 26.9,58.24 26.9,58.78 26.76,58.91 U3.69
  Bottom 0.152: U3.69 26.76,58.91 26.9,58.78 26.9,58.24 v26.49,57.84
GND  (via drill 0.33)
  Top 0.152: U3.15 26.78,69.71 v27.13,70.05
  Top 0.254: U4.6 13.21,64.01 U4.PAD 13.21,64.51 U4.3
  Bottom 0.152: U3.15 26.78,69.71 v27.13,70.05
  other vias: 28.24,71.7 9.02,55.75 15.88,83.19 11.56,91.95 18.92,91.95 18.39,58.04 16.13,59.69 22.73,50.6 24.82,51.23 7.24,67.82 8.89,64.77 10.92,64.64 11.05,67.69 14.48,66.04 12.83,71.37 12.83,69.98 14.86,70.1 6.35,73.41 16.43,73.23 14.86,76.2 20.95,92.71 20.95,90.17 20.95,87.63 20.95,85.09 20.95,82.55 20.95,80.01 20.95,77.47 28.57,75.06 26.04,75.06 23.5,75.06 27.05,73.43 9.53,92.71 6.99,92.71 4.45,92.71 1.27,57.15 5.84,51.31 14.22,47.32 13.97,45.97 15.75,44.45 29.72,57.02 0.89,82.55 0.89,80.01 0.89,77.47 0.89,74.93 15.88,80.64 0.89,71.37 0.89,64.77 19.71,74.02
  pour Bottom (isolate 0.152, rank 6): 30.48,92.2 30.48,51.31 arc-90 28.7,49.53 22.86,49.53 20.32,46.99 20.32,6.35 10.16,6.35 10.16,46.99 7.62,49.53 1.78,49.53 arc-90 0,51.31 0,92.2 arc-90 1.78,93.98 28.7,93.98 arc-90
  pour Top (isolate 0.051, rank 6): 30.48,51.26 arc-90 28.75,49.53 22.86,49.53 20.32,46.99 20.32,6.35 10.16,6.35 10.16,46.99 7.62,49.53 1.78,49.53 arc-90 0,51.31 0,92.2 arc-90 1.78,93.98 28.7,93.98 arc-90 30.48,92.2
GP12_PWM0  (via drill 0.33)
  Top 0.152: U3.35 26.64,65.71 26.82,65.89 v27.33,65.89 | v12.19,81.53 11.71,81.05 11,81.05 10.29,80.34 U6.2
  Bottom 0.152: v27.33,65.89 26.82,65.89 26.64,65.71 U3.35 | U3.35 | U3.35 25.2,65.71 24.54,66.37 24.54,73 23.93,73.61 22.28,73.61 19.18,76.71 17.02,76.71 v12.19,81.53
GP13_PWM1  (via drill 0.33)
  Top 0.152: U3.33 26.61,66.11 27.05,66.55 28.27,66.55 28.4,66.42 28.93,66.42 29.62,67.11 v29.64,67.11 30.07,67.54 30.07,71.53 v28.96,72.64 | v11.05,81.76 10.62,81.33 10.62,81.2 9.89,80.48 U6.3
  Bottom 0.152: U3.33 26.61,66.11 27.05,66.55 28.27,66.55 28.4,66.42 28.93,66.42 29.62,67.11 v29.64,67.11 | v28.96,72.64 27.43,74.17 26.75,74.17 26.57,73.99 22.4,73.99 19.3,77.09 17.65,77.09 12.45,82.3 11.58,82.3 v11.05,81.76
GP14  (via drill 0.33)
  Top 0.152: U3.48 24.63,63.31 25.09,63.78 25.09,73.46 24.26,74.3 22.48,74.3 20.19,76.58 20.19,83.31 v19.3,84.2 | U3.48 | v13.59,82.8 13.59,81.91 12.01,80.34 10.79,80.34 10.69,80.23 U6.1 | U3.48 v21.27,63.31
  Bottom 0.152: v13.59,82.8 14.99,84.2 v19.3,84.2 | U3.48 v21.27,63.31
GP15  (via drill 0.33)
  Top 0.152: U3.42 22.36,64.51 v22.17,64.69
  Bottom 0.152: v22.17,64.69 22.36,64.51 U3.42
GP19_I2C_1_SCL  (via drill 0.33)
  Top 0.152: U3.41 26.66,64.51 26.77,64.62 27.86,64.62 28.04,64.8 29.31,64.8 v29.46,64.95 | U1.2 9.12,67.03 v9.53,67.44 8.89,68.07 R4.1
  Bottom 0.152: v29.46,64.95 29.31,64.8 28.04,64.8 27.86,64.62 26.77,64.62 26.66,64.51 U3.41 24.89,64.51 24.31,63.93 24.31,57.58 23.24,56.52 21.46,56.52 17.02,60.96 12.7,60.96 10.03,63.63 10.03,66.93 v9.53,67.44
GP20_I2C_1_SDA  (via drill 0.33)
  Top 0.152: U3.43 27.23,64.11 v27.38,63.96 | R5.1 7.71,69 8,68.71 8,67.82 v8.38,67.44 8.62,67.2 U1.3
  Bottom 0.152: 27.23,64.11 v27.38,63.96 27.23,64.11 U3.43 | U3.43 | U3.43 24.99,64.11 24.66,63.78 24.66,58.14 27.56,55.25 27.56,54.36 26.29,53.09 24.51,53.09 24.13,53.47 23.11,53.47 22.73,53.85 22.73,54.74 16.89,60.58 12.57,60.58 9.65,63.5 9.65,66.17 v8.38,67.44
GP27_I2C_6_SCL  (via drill 0.33)
  Top 0.152: v28.52,64.14 27.69,63.3 27.1,63.3 26.69,63.71 U3.45
  Bottom 0.152: U3.45 26.69,63.71 27.1,63.3 27.69,63.3 v28.52,64.14
GP28_I2C_6_SDA  (via drill 0.33)
  Top 0.152: U3.47 26.61,63.31 26.92,62.99 27.81,62.99 28.3,63.48 29.03,63.48 v29.52,63.96
  Bottom 0.152: v29.52,63.96 29.03,63.48 28.3,63.48 27.81,62.99 26.92,62.99 26.61,63.31 U3.47
GP40_I2S_2_CLK  (via drill 0.33)
  Top 0.152: U3.52 21.87,62.51 21.69,62.33 v20.32,62.33
  Bottom 0.152: v20.32,62.33 21.69,62.33 21.87,62.51 U3.52
GP41_I2S_2_FS  (via drill 0.33)
  Top 0.152: v21.08,61.67 21.46,61.67 21.9,62.11 U3.54
  Bottom 0.152: U3.54 21.9,62.11 21.46,61.67 v21.08,61.67
GP42_I2S_2_RXD  (via drill 0.33)
  Top 0.152: U3.50 21.84,62.91 21.57,62.64 20.98,62.64 v20.24,63.37
  Bottom 0.152: v20.24,63.37 20.98,62.64 21.57,62.64 21.84,62.91 U3.50
GP43_I2S_2_TXD  (via drill 0.33)
  Top 0.152: U3.56 22.06,61.71 21.36,61.01 20.8,61.01 20.24,61.57 v19.68,61.57
  Bottom 0.152: v19.68,61.57 20.24,61.57 20.8,61.01 21.36,61.01 22.06,61.71 U3.56
GP44  (via drill 0.33)
  Top 0.152: U3.24 22.34,68.11 22.05,67.82 21.41,67.82 v20.75,68.48 | v9.91,81.53 9.49,81.12 U6.4
  Bottom 0.152: v20.75,68.48 21.41,67.82 22.05,67.82 22.34,68.11 U3.24 24.09,68.11 24.18,68.2 24.18,72.72 23.67,73.23 22.15,73.23 19.05,76.33 16.64,76.33 12.19,80.77 10.67,80.77 v9.91,81.53
GP45  (via drill 0.33)
  Top 0.152: v19.74,68.48 20.4,67.82 20.98,67.82 21.29,67.51 22.17,67.51 22.37,67.71 U3.26 | v7.49,82.3 7.49,81.41 8.29,80.61 U6.7
  Bottom 0.152: U3.26 22.37,67.71 22.17,67.51 21.29,67.51 20.98,67.82 20.4,67.82 v19.74,68.48 18.64,68.48 14.86,72.26 14.86,73.41 7.49,80.77 v7.49,82.3
GP46  (via drill 0.33)
  Top 0.152: U3.28 22.4,67.31 22.3,67.21 21.16,67.21 20.85,67.51 19.86,67.51 v19.81,67.46 | U6.8 7.89,80.48 v6.83,81.53
  Bottom 0.152: v19.81,67.46 19.86,67.51 | 19.86,67.51 20.85,67.51 21.16,67.21 22.3,67.21 22.4,67.31 U3.28 | 19.86,67.51 18.85,67.51 14.48,71.88 14.48,73.15 6.83,80.8 v6.83,81.53
GP47  (via drill 0.33)
  Top 0.152: v20.6,66.83 20.68,66.9 22.43,66.9 22.43,66.91 U3.30 24.16,66.91 24.38,67.13 24.38,73.03 23.88,73.53 22.23,73.53 19.43,76.33 19.43,82.55 17.4,84.58 12.95,84.58 12.7,84.84 8.51,84.84 5.71,82.04 5.71,81.51 6.35,80.87 7.04,80.87 7.49,80.42 U6.9
  Bottom 0.152: v20.6,66.83 20.68,66.9 22.43,66.9 22.43,66.91 U3.30
GP48  (via drill 0.33)
  Top 0.152: v21.41,66.24 21.68,66.51 U3.32 24.37,66.51 24.74,66.88 24.74,73.3 24.13,73.91 22.35,73.91 19.81,76.45 19.81,82.68 17.53,84.96 13.21,84.96 12.95,85.22 8.38,85.22 5.33,82.17 5.33,81.43 6.22,80.54 6.88,80.54 7.09,80.34 U6.10
  Bottom 0.152: U3.32 21.68,66.51 v21.41,66.24
GP49  (via drill 0.33)
  Top 0.152: U3.34 22.22,66.11 21.69,65.58 21.13,65.58 20.55,66.17 19.94,66.17 v19.66,66.45
  Bottom 0.152: v19.66,66.45 19.94,66.17 20.55,66.17 21.13,65.58 21.69,65.58 22.22,66.11 U3.34
GP77_SD_0_CD#  (via drill 0.33)
  Top 0.152: U3.60 22.12,60.91 21.59,60.38 21.29,60.38 v20.95,60.05
  Bottom 0.152: v20.95,60.05 21.29,60.38 21.59,60.38 22.12,60.91 U3.60
GP78_SD_0_CLK  (via drill 0.33)
  Top 0.152: U3.58 22.09,61.31 21.49,60.71 20.17,60.71 v20.14,60.68
  Bottom 0.152: v20.14,60.68 20.17,60.71 21.49,60.71 22.09,61.31 U3.58
GP79_SD_0_CMD  (via drill 0.33)
  Top 0.152: U3.62 22.16,60.51 21.64,60 21.64,59.79 21.23,59.39 20.3,59.39 v19.99,59.69
  Bottom 0.152: v19.99,59.69 20.3,59.39 21.23,59.39 21.64,59.79 21.64,60 22.16,60.51 U3.62
GP80_SD_0_DAT0  (via drill 0.33)
  Top 0.152: v21.31,58.42 21.31,58.57 22.45,59.71 U3.66
  Bottom 0.152: U3.66 22.45,59.71 21.31,58.57 v21.31,58.42
GP81_SD_0_DAT1  (via drill 0.33)
  Top 0.152: U3.70 22.56,58.91 22.38,58.73 22.38,58.32 22.99,57.71 v23.04,57.71
  Bottom 0.152: v23.04,57.71 22.99,57.71 22.38,58.32 22.38,58.73 22.56,58.91 U3.70
GP82_SD_0_DAT2  (via drill 0.33)
  Top 0.152: U3.64 22.19,60.11 21.95,59.87 21.95,59.64 21.39,59.08 20.7,59.08 v20.34,58.73
  Bottom 0.152: v20.34,58.73 20.7,59.08 21.39,59.08 21.95,59.64 21.95,59.87 22.19,60.11 U3.64
GP83_SD_0_DAT3  (via drill 0.33)
  Top 0.152: v22,57.68 22,58.78 22.53,59.31 U3.68
  Bottom 0.152: U3.68 22.53,59.31 22,58.78 v22,57.68
GP84_SD_CLK_FB  (via drill 0.33)
  Top 0.152: U3.44 22.48,64.11 22.4,64.03 21.9,64.03 21.32,64.62 v21.16,64.62
  Bottom 0.152: v21.16,64.62 21.32,64.62 21.9,64.03 22.4,64.03 22.48,64.11 U3.44 | U3.44
GP109_SPI_2_CLK  (via drill 0.33)
  Top 0.152: v29.64,62.97 29.64,62.64 28.98,61.98 28.75,61.98 28.14,61.37 27.33,61.37 26.99,61.71 U3.55 25.16,61.71 24.79,61.34 24.79,58.01 27.18,55.63 27.18,54.1 26.16,53.09 26.16,51.31 25.4,50.55 24.26,50.55 22.73,52.07 22.73,52.7 21.97,53.47 18.92,53.47 18.14,54.25 U7.3
  Bottom 0.152: v29.64,62.97 29.64,62.64 28.98,61.98 28.75,61.98 28.14,61.37 27.33,61.37 26.99,61.71 U3.55
GP110_SPI_2_FS0  (via drill 0.33)
  Top 0.152: v28.7,62.64 28.7,62.36 28.02,61.67 27.46,61.67 27.02,62.11 U3.53 24.95,62.11 24.43,61.59 24.43,57.96 23.47,57 20.98,57 19.18,58.8 18.03,58.8 17.65,58.42 17.65,57.02 16.88,56.25 U7.8
  Bottom 0.152: U3.53 27.02,62.11 27.46,61.67 28.02,61.67 28.7,62.36 v28.7,62.64
GP111_SPI_2_FS1  (via drill 0.33)
  Top 0.152: v27.74,62.33 27.56,62.51 U3.51 | v16.76,57.91 17.27,57.4 17.27,57.15 16.77,56.65 U7.9
  Bottom 0.152: 25.25,62.51 25.02,62.28 25.02,58.29 27.94,55.37 27.94,54.1 26.54,52.7 24.38,52.7 24,53.09 22.86,53.09 22.35,53.59 22.35,54.61 19.56,57.4 18.8,57.4 18.67,57.28 17.4,57.28 v16.76,57.91 | 25.25,62.51 | v27.74,62.33 27.56,62.51 U3.51 | U3.51 | U3.51 25.25,62.51 | U3.51
GP114_SPI_2_RXD  (via drill 0.33)
  Top 0.152: U3.59 26.92,60.91 27.08,60.76 28.91,60.76 v29.03,60.88 | v23.62,52.32 22.1,53.85 19.05,53.85 18.25,54.65 U7.4
  Bottom 0.152: U3.59 26.92,60.91 27.08,60.76 28.91,60.76 v29.03,60.88 29.72,60.2 29.72,59.05 28.32,57.66 28.32,53.98 26.67,52.32 v23.62,52.32
GP115_SPI_2_TXD  (via drill 0.33)
  Top 0.152: U3.57 26.95,61.31 27.2,61.06 28.27,61.06 28.88,61.67 29.62,61.67 v29.64,61.7 | v19.18,56.64 17.78,56.64 16.98,55.84 U7.7
  Bottom 0.152: v29.64,61.7 29.62,61.67 28.88,61.67 28.27,61.06 27.2,61.06 26.95,61.31 U3.57 | 29.97,61.37 v29.64,61.7 | v29.64,61.7 30.07,61.27 30.07,58.78 28.7,57.4 28.7,53.85 26.8,51.94 24.26,51.94 23.88,51.56 22.48,51.56 22.1,51.94 22.1,53.34 19.18,56.26 v19.18,56.64
GP128_UART_1_CTS  (via drill 0.33)
  Top 0.152: U3.65 26.9,59.71 27.84,58.78 v27.91,58.78
  Bottom 0.152: v27.91,58.78 27.84,58.78 26.9,59.71 U3.65
GP129_UART_1_RTS  (via drill 0.33)
  Top 0.152: v28.93,59.87 28.5,59.44 27.66,59.44 26.99,60.11 U3.63
  Bottom 0.152: U3.63 26.99,60.11 27.66,59.44 28.5,59.44 v28.93,59.87
GP130_UART_1_RX  (via drill 0.33)
  Top 0.152: v27.94,60.1 27.61,60.43 26.95,60.43 26.87,60.51 U3.61 25.28,60.51 25.15,60.38 25.15,58.17 27.56,55.75 27.56,53.98 26.54,52.96 26.54,51.18 25.53,50.16 24.13,50.16 22.35,51.94 22.35,52.58 21.84,53.09 18.8,53.09 18.04,53.84 U7.2
  Bottom 0.152: U3.61 26.87,60.51 26.95,60.43 27.61,60.43 v27.94,60.1
GP131_UART_1_TX  (via drill 0.33)
  Top 0.152: U3.46 22.52,63.71 22.5,63.73 21.77,63.73 21.54,63.96 20.85,63.96 20.3,64.52 v20.07,64.52 18.92,63.37 18.92,59.56 18.54,59.18 16.76,59.18 15.24,57.66 15.24,53.59 15.39,53.45 U7.1
  Bottom 0.152: v20.07,64.52 20.3,64.52 20.85,63.96 21.54,63.96 21.77,63.73 22.5,63.73 22.52,63.71 U3.46
GP134_UART_2_RX  (via drill 0.33)
  Top 0.152: v21.77,68.48 21.8,68.51 U3.22
  Bottom 0.152: U3.22 21.8,68.51 v21.77,68.48
GP135_UART_2_TX  (via drill 0.33)
  Top 0.152: v29.39,68.07 29.06,68.07 28.73,67.74 28.35,67.74 27.76,67.16 27.23,67.16 27.08,67.31 U3.27
  Bottom 0.152: U3.27 27.08,67.31 27.23,67.16 27.76,67.16 28.35,67.74 28.73,67.74 29.06,68.07 v29.39,68.07
GP165  (via drill 0.33)
  Top 0.152: v27.48,67.82 27.38,67.71 U3.25
  Bottom 0.152: U3.25 27.38,67.71 v27.48,67.82
GP182_PWM2  (via drill 0.33)
  Top 0.152: U3.37 27.02,65.31 27.1,65.23 27.61,65.23 28.14,65.76 v28.32,65.76
  Bottom 0.152: v28.32,65.76 28.14,65.76 27.61,65.23 27.1,65.23 27.02,65.31 U3.37
GP183_PWM3  (via drill 0.33)
  Top 0.152: v29.39,65.94 29.39,65.89 28.6,65.1 27.91,65.1 27.74,64.92 26.62,64.92 26.61,64.91 U3.39
  Bottom 0.152: U3.39 26.61,64.91 26.62,64.92 27.74,64.92 27.91,65.1 28.6,65.1 29.39,65.89 v29.39,65.94
HV_SCL  (via drill 0.33)
  Top 0.152: R2.1 5.08,59.94 5.33,60.2 5.59,60.2 v6.48,61.09 8.26,61.09 8.62,61.45 U1.6
  Bottom 0.152: JP1.5 12.39,38.41 12.39,50.6 10.41,52.58 9.14,52.58 6.48,55.25 v6.48,61.09
HV_SDA  (via drill 0.33)
  Top 0.152: R1.1 3.17,60.33 3.56,60.71 5.33,60.71 5.59,60.96 5.59,61.72 5.84,61.98 v7.24,61.98 8.12,62.86 U1.5
  Bottom 0.152: JP1.3 12.75,40.59 12.75,50.75 10.41,53.09 9.4,53.09 7.24,55.25 v7.24,61.98
MSIC_SLP_CLK  (via drill 0.33)
  Top 0.152: v27.51,70.99 27.19,71.31 U3.7
  Bottom 0.152: U3.7 27.19,71.31 v27.51,70.99
N$1
  Top 0.152: R3.1 6.99,60.07 7.11,60.2 8.13,60.2 9.12,61.19 U1.7 9.12,62.77 9.12,62.76 9.47,62.76 9.62,62.91 U1.8
N$2
  Top 0.381: JP3.VBUS1 16.54,86.46 F1.1
N$3  (via drill 0.33)
  Top 0.381: SJ1.2 7.8,87.56 8.2,87.96 v8.2,89.41 | v8.2,89.41 8.2,89.81 | v8.2,89.41 8.2,89.92 8.41,90.12 9.12,90.12 9.27,89.97 D1.C
  Bottom 0.381: TP1.P$1 8.26,89.46 v8.2,89.41
N$4
  Top 0.152: SJ2.3 4.9,56.19 4.7,56.39 3.43,56.39 3.17,56.64 R1.2
N$5
  Top 0.152: R2.2 5.08,56.64 5.33,56.39 6.35,56.39 6.53,56.21 SJ2.1
N$12
  Top 0.254: D3.C 1.02,89.66 1.27,89.92 1.78,89.92 2.54,89.15 R6.2
N$13
  Top 0.254: R6.1 2.63,87.5 SJ3.2
N$15
  Top 0.254: R10.2 2.16,61.59 1.78,61.98 S1.2 1.78,66.19 2.95,66.19 3.39,66.64 R9.2
N$16
  Top 0.254: Q1.1 3.79,77.2 3.56,76.96 R11.1
N$18  (via drill 0.51)
  Top 0.254: U4.4 12.71,66.18 v12.83,66.29
  Bottom 0.254: v12.83,66.29 12.83,65.66 v16.51,61.98
  pour Top: 15.49,64.01 18.29,64.01 18.29,61.21 16.51,61.21 15.49,62.23
N$19
  Top 0.254: U4.2 13.71,68.06 L1.P$1
OSC_CLK_OUT  (via drill 0.33)
  Top 0.152: v27.51,57.86 27.23,58.14 27.23,58.9 26.82,59.31 U3.67
  Bottom 0.152: U3.67 26.82,59.31 27.23,58.9 27.23,58.14 v27.51,57.86
PI_CE0  (via drill 0.33)
  Top 0.152: JP1.24 18.09,15.55 18.09,50.09 18.8,50.8 v20.57,50.8 | v13.84,59.69 12.83,58.67 12.83,56.64 13.22,56.25 U7.13
  Bottom 0.152: v20.57,50.8 20.57,53.72 18.03,56.26 16.26,56.26 13.84,58.67 v13.84,59.69
PI_CE1  (via drill 0.33)
  Top 0.152: JP1.26 18.44,13.36 18.44,49.28 19.2,50.04 20.95,50.04 v21.72,50.8 | v14.99,59.69 13.34,58.04 13.34,56.9 13.59,56.65 U7.12
  Bottom 0.152: v21.72,50.8 21.72,53.09 18.16,56.64 16.51,56.64 14.99,58.17 v14.99,59.69
PI_GP4  (via drill 0.33)
  Top 0.152: v10.67,73.15 11.94,74.42 11.94,75.95 10.69,77.19 U6.20
  Bottom 0.152: JP1.7 12.04,36.22 12.04,50.44 10.41,52.07 8.89,52.07 5.21,55.75 5.21,66.93 10.67,72.39 v10.67,73.15
PI_GP17  (via drill 0.33)
  Top 0.152: v9.53,72.64 9.53,73.28 11.43,75.18 11.43,75.95 10.29,77.09 U6.19
  Bottom 0.152: JP1.11 11.68,31.5 11.68,50.29 10.41,51.56 8.64,51.56 4.83,55.37 4.83,67.94 v9.53,72.64
PI_GP18#  (via drill 0.33)
  Top 0.152: v5.97,63.25 7.11,64.39 7.11,66.8 6.1,67.82 6.1,71.63 6.86,72.39 8.13,72.39 10.92,75.18 10.92,75.95 9.89,76.98 U6.18
  Bottom 0.152: JP1.12 19.02,31.73 19.02,52.73 17.78,53.98 15.11,53.98 14.1,54.99 14.1,56.39 12.06,58.42 12.06,58.8 11.43,59.44 9.4,59.44 8.38,60.45 8.38,63.12 7.49,64.01 6.73,64.01 v5.97,63.25
PI_GP22  (via drill 0.33)
  Top 0.152: v7.75,73.15 8.51,73.91 9.14,73.91 10.41,75.18 10.41,75.95 9.49,76.87 U6.17
  Bottom 0.152: JP1.15 10.97,27.13 10.97,49.99 10.41,50.55 8.13,50.55 4.06,54.61 4.06,69.47 v7.75,73.15
PI_GP23  (via drill 0.33)
  Top 0.152: v5.97,64.52 6.73,65.28 6.73,66.55 5.46,67.82 5.46,75.95 5.64,76.12 7.7,76.12 8.29,76.72 U6.14
  Bottom 0.152: JP1.16 19.38,27 19.38,53.01 18.03,54.36 15.24,54.36 14.48,55.12 14.48,56.52 12.45,58.55 12.45,58.93 11.56,59.82 9.65,59.82 8.76,60.71 8.76,63.25 7.49,64.52 v5.97,64.52
PI_GP24  (via drill 0.33)
  Top 0.152: v5.97,65.79 5.08,66.67 5.08,76.2 5.36,76.48 7.57,76.48 7.89,76.8 U6.13
  Bottom 0.152: JP1.18 19.74,24.82 19.74,53.29 18.29,54.74 15.37,54.74 14.86,55.25 14.86,56.64 12.83,58.67 12.83,59.05 11.68,60.2 9.78,60.2 9.14,60.83 9.14,63.37 6.73,65.79 v5.97,65.79
PI_GP25  (via drill 0.33)
  Top 0.152: JP1.22 17.73,17.73 17.73,50.09 v17.27,50.55 | v7.24,63.25 6.48,62.48 5.59,62.48 4.7,63.37 4.7,76.45 5.08,76.84 7.37,76.84 7.49,76.96 U6.12
  Bottom 0.152: v7.24,63.25 8,62.48 8,60.2 9.14,59.05 11.3,59.05 11.68,58.67 11.68,58.29 13.72,56.26 13.72,54.74 14.86,53.59 17.53,53.59 18.29,52.83 18.29,51.56 v17.27,50.55
PI_GP27  (via drill 0.33)
  Top 0.152: U6.11 7.09,77.25 7.04,77.19 5.79,77.19 5.46,77.52 v5.46,78.61
  Bottom 0.152: JP1.13 11.33,29.31 11.33,50.14 10.41,51.05 8.38,51.05 4.45,54.99 4.45,68.71 8.64,72.9 8.64,75.44 v5.46,78.61
PI_MISO  (via drill 0.33)
  Top 0.152: JP1.21 11.94,18.54 11.94,42.29 15.49,45.85 15.49,48.13 13.59,50.04 v13.59,51.69 | v11.43,53.72 12.35,54.65 U7.17
  Bottom 0.152: v11.43,53.72 12.45,53.72 13.59,52.58 v13.59,51.69
PI_MOSI  (via drill 0.33)
  Top 0.152: JP1.19 12.29,20.73 12.29,42.14 15.88,45.72 15.88,48.77 v14.35,50.29 | v12.06,56.13 12.7,56.13 12.99,55.84 U7.14
  Bottom 0.152: v14.35,50.29 14.35,52.58 12.57,54.36 12.57,55.63 v12.06,56.13
PI_RXI  (via drill 0.33)
  Top 0.152: U7.19 12.9,53.84 12.8,53.75 12.8,53.54 15.04,51.31 v15.49,51.31
  Bottom 0.152: JP1.10 18.67,33.91 18.67,48.13 v15.49,51.31
PI_SCLK
  Top 0.152: JP1.23 11.58,16.36 11.58,42.44 15.11,45.97 15.11,47.88 12.93,50.06 12.93,52.86 12.45,53.34 12.45,54.1 12.59,54.25 U7.18
PI_TXO  (via drill 0.33)
  Top 0.152: U7.20 13.74,53.45 13.69,53.39 13.69,53.26 14.5,52.45 v15.49,52.45
  Bottom 0.152: JP1.8 18.31,36.09 18.31,47.47 14.73,51.05 14.73,51.69 v15.49,52.45
PSW  (via drill 0.33)
  Top 0.152: v29.21,69.06 29.18,69.09 28.17,69.09 27.86,68.78 27.05,68.78 26.78,68.51 U3.21
  Bottom 0.152: U3.21 26.78,68.51 27.05,68.78 27.86,68.78 28.17,69.09 29.18,69.09 v29.21,69.06
PWRBTN#  (via drill 0.33)
  Top 0.152: v28.19,70.05 27.53,69.39 26.8,69.39 26.71,69.31 U3.17 | R10.1 4.66,62.65 4.45,62.87 v2.79,62.87
  Bottom 0.152: U3.17 26.71,69.31 26.8,69.39 27.53,69.39 v28.19,70.05 28.19,70.1 29.72,71.63 29.72,73.28 28.96,74.04 28.19,74.04 27.69,74.55 26.62,74.55 26.44,74.37 22.53,74.37 19.43,77.47 17.91,77.47 12.57,82.8 12.57,83.19 13.46,84.07 13.46,86.87 12.95,87.38 4.32,87.38 1.78,84.84 1.78,63.88 v2.79,62.87
RCVR_MODE  (via drill 0.33)
  Top 0.152: v28.65,67.08 28.12,67.08 27.89,66.85 26.92,66.85 26.58,66.51 U3.31
  Bottom 0.152: U3.31 26.58,66.51 26.92,66.85 27.89,66.85 28.12,67.08 v28.65,67.08
RESET_OUT#  (via drill 0.33)
  Top 0.152: U3.36 22.25,65.71 21.82,65.28 20.5,65.28 v20.27,65.51
  Bottom 0.152: v20.27,65.51 20.5,65.28 21.82,65.28 22.25,65.71 U3.36
USB_DN  (via drill 0.33)
  Top 0.152: U3.18 22.64,69.31 22.5,69.44 20.88,69.44 20.14,70.18 19.51,70.18 v18.85,69.52
  Bottom 0.152: U3.18 22.64,69.31 22.5,69.44 20.88,69.44 20.14,70.18 19.51,70.18 v18.85,69.52
USB_DP  (via drill 0.33)
  Top 0.152: U3.16 22.67,69.71 22.63,69.75 21.01,69.75 20.22,70.54 19.33,70.54 v19.13,70.74
  Bottom 0.152: U3.16 22.67,69.71 22.63,69.75 21.01,69.75 20.22,70.54 19.33,70.54 v19.13,70.74
USB_ID  (via drill 0.33)
  Top 0.152: v27.51,72.39 27.23,72.11 U3.3
  Bottom 0.152: U3.3 27.23,72.11 v27.51,72.39
USB_VBUS  (via drill 0.33)
  Top 0.152: v19.86,69.52 20.24,69.14 22.28,69.14 22.5,68.91 U3.20
  Bottom 0.152: U3.20 22.5,68.91 22.28,69.14 20.24,69.14 v19.86,69.52
V_BAT_BKUP  (via drill 0.33)
  Top 0.152: v28.45,68.4 28.37,68.48 27.18,68.48 26.81,68.11 U3.23
  Bottom 0.152: U3.23 26.81,68.11 27.18,68.48 28.37,68.48 v28.45,68.4
VSYS  (via drill 0.33)
  Top 0.2: U3.4 v22.08,72.11
  Top 0.254: U5.1 16.82,83.06 | 16.82,83.06 16.82,83.63 16.38,84.07 14.99,84.07 | 16.82,83.06 17.53,83.06 17.78,82.8 17.78,71.88 17.53,71.63 C8.1 | 14.99,84.07 v12.19,84.07 | U5.3 14.93,84.01 14.99,84.07 | D3.A 1.02,86.23 1.69,85.56 | 1.69,85.56 Q1.3 R9.1 | 9.27,85.98 7.87,85.98 7.37,86.49 2.62,86.49 1.69,85.56 | 9.27,85.98 v10.79,85.98 | D1.A 9.27,85.98
  Bottom 0.198: U3.2 22.48,72.51 v22.08,72.11 22.48,71.71 U3.6
  Bottom 0.2: v22.08,72.11 U3.4
  Bottom 0.254: v12.19,84.07 10.79,85.47 v10.79,85.98
  pour Top: 16.26,72.52 23.37,72.52 23.37,71.63 21.34,71.63 19.3,69.6 19.3,67.82 18.29,66.8 18.29,64.52 15.49,64.52 15.49,66.55 16.26,67.31

### Text on the board
Top: v10
tPlace: LED / EN | VSYS / EN | PWR | Pi Block | POWER | I2C PUs | RPi B / Header
bPlace: Pi Block | 4xM2.0 | 3.3V | 5V | SDA | 5V | SCL | GND | GP14 | TXO | GND | RXI | GP12 | GP13 | GP48 | GND | GP44 | GP45 | 3.3V | GP46 | MOSI | GND | MISO | GP47 | SCK | CE0 | GND | CE1
tDocu: NOTES: / - Board thickness = 0.063 in. | Shawn Hymel